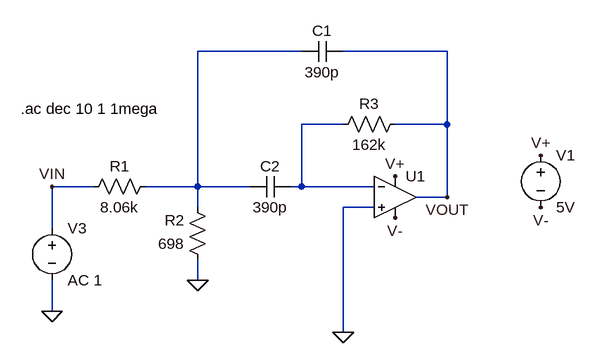
[diagram p0: schematic band pass one op amp.asc]
band pass one op amp.asc, the LTspice schematic file:
Version 4.1
SHEET 1 880 680
WIRE 320 -80 160 -80
WIRE 544 -80 384 -80
WIRE 384 32 320 32
WIRE 544 32 544 -80
WIRE 544 32 464 32
WIRE 0 128 -64 128
WIRE 160 128 160 -80
WIRE 160 128 80 128
WIRE 240 128 160 128
WIRE 320 128 320 32
WIRE 320 128 304 128
WIRE 432 128 320 128
WIRE 544 144 544 32
WIRE 544 144 496 144
WIRE 160 160 160 128
WIRE 432 160 384 160
WIRE -64 192 -64 128
WIRE 160 272 160 240
WIRE -64 320 -64 272
WIRE 384 352 384 160
FLAG 160 272 0
FLAG 384 352 0
FLAG -64 320 0
FLAG 544 144 VOUT
FLAG -64 128 VIN
FLAG 688 160 V-
FLAG 464 176 V-
FLAG 464 112 V+
FLAG 688 80 V+
SYMBOL res 96 112 R90
WINDOW 0 0 56 VBottom 2
WINDOW 3 32 56 VTop 2
SYMATTR InstName R1
SYMATTR Value 8.06k
SYMBOL res 176 256 R180
WINDOW 0 36 76 Left 2
WINDOW 3 36 40 Left 2
SYMATTR InstName R2
SYMATTR Value 698
SYMBOL res 480 16 R90
WINDOW 0 0 56 VBottom 2
WINDOW 3 32 56 VTop 2
SYMATTR InstName R3
SYMATTR Value 162k
SYMBOL cap 384 -96 R90
WINDOW 0 0 32 VBottom 2
WINDOW 3 32 32 VTop 2
SYMATTR InstName C1
SYMATTR Value 390p
SYMBOL cap 304 112 R90
WINDOW 0 0 32 VBottom 2
WINDOW 3 32 32 VTop 2
SYMATTR InstName C2
SYMATTR Value 390p
SYMBOL OpAmps\\UniversalOpAmp 464 144 R0
SYMATTR InstName U1
SYMBOL voltage 688 64 R0
SYMATTR InstName V1
SYMATTR Value 5V
SYMBOL voltage -64 176 R0
SYMATTR InstName V3
SYMATTR Value AC 1
TEXT -112 8 Left 2 !.ac dec 10 1 1mega

The netlist it stands for:
* band pass one op amp.asc
R1 N001 VIN 8.06k
R2 0 N001 698
R3 VOUT N002 162k
C1 VOUT N001 390p
C2 N002 N001 390p
X§U1 0 N002 V+ V- VOUT level1 Avol=1Meg GBW=10Meg Vos=0 En=0 Enk=0 In=0 Ink=0 Rin=500Meg  ; pins In+ In- V+ V- OUT
V1 V+ V- 5V
V3 VIN 0 AC 1
.ac dec 10 1 1mega
.lib UniversalOpAmp1.lib
.backanno
.end